# Altium schematic sheet 400M.SchDoc
size A4
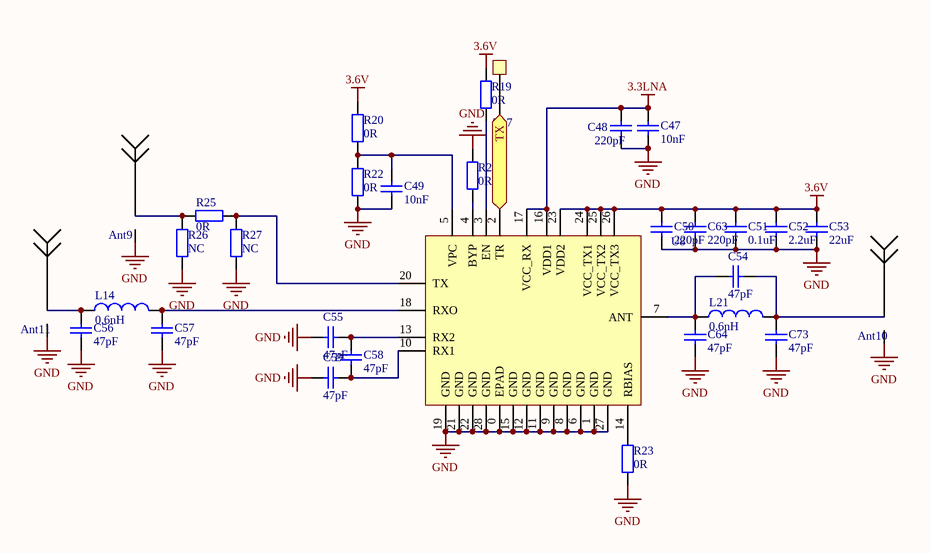
[diagram p0: 400M.SchDoc]

## Parts
Ant9  Antenna  [SMA-2]  (value not drawn)
Ant10  Antenna  [SMA-2]  (value not drawn)
Ant11  Antenna  [SMA-2]  (value not drawn)
C47  value 10nF  [0402]  (hidden comment: Cap)
C48  value 220pF  [0402]  (hidden comment: Cap)
C49  value 10nF  [0402]  (hidden comment: Cap)
C50  value 220pF  [0402]  (hidden comment: Cap)
C51  value 0.1uF  [0402]  (hidden comment: Cap)
C52  value 2.2uF  [0603]  (hidden comment: Cap)
C53  value 22uF  [0805]  (hidden comment: Cap)
C54  value 47pF  [0402]  (hidden comment: Cap)
C55  value 47pF  [0402]  (hidden comment: Cap)
C56  value 47pF  [0402]  (hidden comment: Cap)
C57  value 47pF  [0402]  (hidden comment: Cap)
C58  value 47pF  [0402]  (hidden comment: Cap)
C59  value 47pF  [0402]  (hidden comment: Cap)
C63  value 220pF  [0402]  (hidden comment: Cap)
C64  value 47pF  [0402]  (hidden comment: Cap)
C73  value 47pF  [0402]  (hidden comment: Cap)
L14  value 0.6nH  [0402]  (hidden comment: Inductor)
L21  value 0.6nH  [0402]  (hidden comment: Inductor)
R19  value 0R  [0402]  (hidden comment: Res2)
R20  value 0R  [0402]  (hidden comment: Res2)
R21  value 0R  [0402]  (hidden comment: Res2)
R22  value 0R  [0402]  (hidden comment: Res2)
R23  value 0R  [0402]  (hidden comment: Res2)
R25  value 0R  [0402]  (hidden comment: Res2)
R26  value NC  [0402]  (hidden comment: Res2)
R27  value NC  [0402]  (hidden comment: Res2)
T17  TestPad  [TestPad - 1mm]  (value not drawn)
U8  SKY65366  [SKY65366]  (value not drawn)

## Ports
TX

## Nets
3.3LNA: C47.2 C48.2 U8.16(VDD1) U8.17(VCC_RX)
3.6V: C50.2 C51.2 C52.2 C53.2 C63.2 R19.2 R20.1 U8.23(VDD2) U8.24(VCC_TX1) U8.25(VCC_TX2) U8.26(VCC_TX3)
GND: Ant9.GND(G) Ant10.GND(G) Ant11.GND(G) C47.1 C48.1 C49.2 C50.1 C51.1 C52.1 C53.1 C55.1 C56.1 C57.1 C59.1 C63.1 C64.1 C73.1 R21.2 R22.2 R23.2 R26.2 R27.2 U8.0(EPAD) U8.1(GND) U8.6(GND) U8.8(GND) U8.9(GND) U8.11(GND) U8.12(GND) U8.15(GND) U8.19(GND) U8.21(GND) U8.22(GND) U8.27(GND) U8.28(GND)
TX: T17.1 U8.2(TR) ; port TX
NetAnt9_1: Ant9.1 R25.1 R26.1
NetAnt10_1: Ant10.1 C54.2 C73.2 L21.2
NetAnt11_1: Ant11.1 C56.2 L14.1
NetC49_1: C49.1 R20.2 R22.1 U8.5(VPC)
NetC54_1: C54.1 C64.2 L21.1 U8.7(ANT)
NetC55_2: C55.2 C58.1 U8.13(RX2)
NetC57_2: C57.2 L14.2 U8.18(RXO)
NetC58_2: C58.2 C59.2 U8.10(RX1)
NetR19_1: R19.1 U8.3(EN)
NetR21_1: R21.1 U8.4(BYP)
NetR23_1: R23.1 U8.14(RBIAS)
NetR25_2: R25.2 R27.1 U8.20(TX)

## Library data of the parts
C47-C59 C63 C64 C73 = Cap: Capacitor; Published: 8-Jun-2000; LatestRevisionDate: 17-Jul-2002; LatestRevisionNote: Re-released for DXP Platform.; PackageReference: RAD-0.3; Publisher: Altium Limited; PackageDescription: Radial Cap, Thru-Hole; 2 Leads; 0.3 in Pin Spacing
L14 L21 = Inductor: Code_IEC: 1005; Published: 8-Jun-2000; LatestRevisionDate: 29-May-2009; LatestRevisionNote: IPC-7351 Footprint Added.; PackageReference: 0402-A; Publisher: Altium Limited; PackageDescription: Chip Inductor; Code_JEITA: 0402
R19-R23 R25-R27 = Res2: Resistor; Published: 8-Jun-2000; LatestRevisionDate: 17-Jul-2002; LatestRevisionNote: Re-released for DXP Platform.; PackageReference: AXIAL-0.4; Publisher: Altium Limited; PackageDescription: Axial Device, Thru-Hole; 2 Leads; 0.4 in Pin Spacing